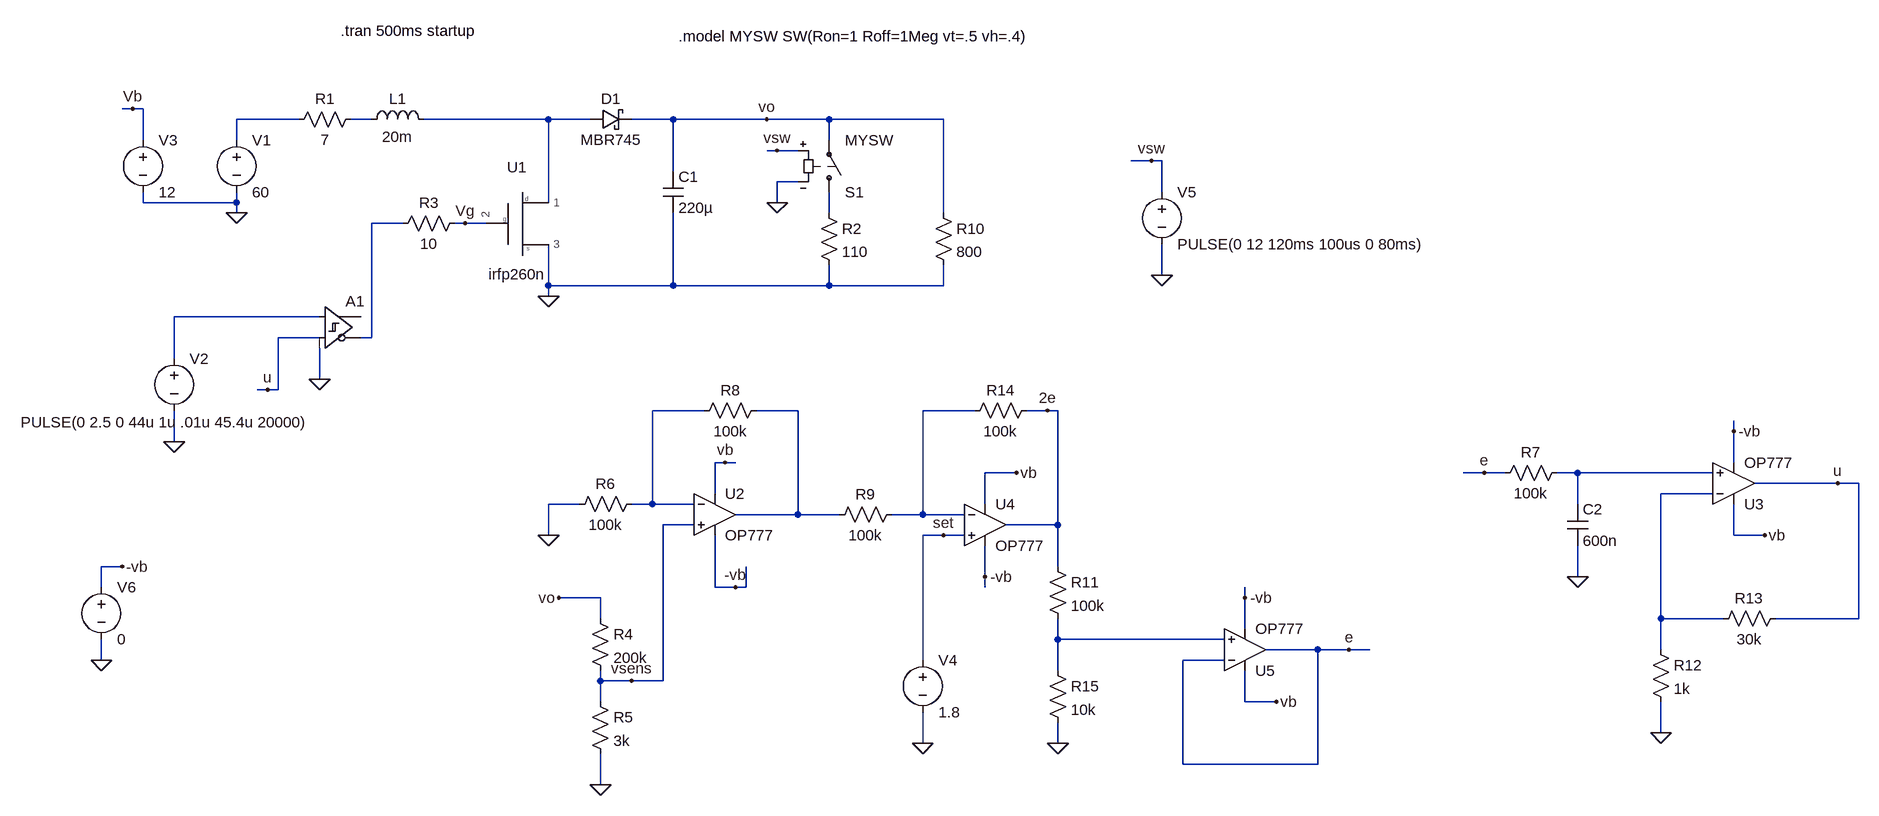
[diagram p0: schematic boost_control.asc]
boost_control.asc, the LTspice schematic file:
Version 4
SHEET 1 2420 1188
WIRE -240 48 -256 48
WIRE -224 48 -240 48
WIRE 16 64 -80 64
WIRE 128 64 96 64
WIRE 400 64 208 64
WIRE 464 64 400 64
WIRE 592 64 528 64
WIRE 736 64 592 64
WIRE 832 64 736 64
WIRE 1008 64 832 64
WIRE -224 96 -224 48
WIRE -80 96 -80 64
WIRE 832 96 832 64
WIRE 752 112 736 112
WIRE 784 112 752 112
WIRE 1328 128 1296 128
WIRE 1344 128 1328 128
WIRE 592 144 592 64
WIRE 784 160 752 160
WIRE 1344 176 1344 128
WIRE -224 192 -224 176
WIRE -80 192 -80 176
WIRE -80 192 -224 192
WIRE 400 192 400 64
WIRE 752 192 752 160
WIRE -80 208 -80 192
WIRE 832 208 832 176
WIRE 1008 208 1008 64
WIRE 176 224 128 224
WIRE 272 224 256 224
WIRE 304 224 272 224
WIRE 1344 304 1344 256
WIRE 400 320 400 256
WIRE 592 320 592 208
WIRE 592 320 400 320
WIRE 832 320 832 288
WIRE 832 320 592 320
WIRE 1008 320 1008 288
WIRE 1008 320 832 320
WIRE 400 336 400 320
WIRE 48 368 -176 368
WIRE 48 400 -16 400
WIRE 128 400 128 224
WIRE 128 400 112 400
WIRE -176 432 -176 368
WIRE 48 464 48 416
WIRE -32 480 -48 480
WIRE -16 480 -16 400
WIRE -16 480 -32 480
WIRE 640 512 560 512
WIRE 784 512 720 512
WIRE 1056 512 976 512
WIRE 1168 512 1136 512
WIRE 1184 512 1168 512
WIRE 2224 544 2224 528
WIRE -176 560 -176 512
WIRE 672 592 656 592
WIRE 688 592 672 592
WIRE 2224 592 2224 544
WIRE 1120 608 1072 608
WIRE 1840 608 1808 608
WIRE 1872 608 1840 608
WIRE 1984 608 1952 608
WIRE 2192 608 1984 608
WIRE 2384 624 2256 624
WIRE 2416 624 2384 624
WIRE 656 640 656 592
WIRE 2192 640 2112 640
WIRE 448 656 400 656
WIRE 560 656 560 512
WIRE 560 656 528 656
WIRE 624 656 560 656
WIRE 1072 656 1072 608
WIRE 1984 656 1984 608
WIRE 784 672 784 512
WIRE 784 672 688 672
WIRE 848 672 784 672
WIRE 976 672 976 512
WIRE 976 672 928 672
WIRE 1040 672 976 672
WIRE 624 688 576 688
WIRE 1184 688 1184 512
WIRE 1184 688 1104 688
WIRE 400 704 400 656
WIRE 1008 704 976 704
WIRE 1040 704 1008 704
WIRE 2224 704 2224 656
WIRE 2272 704 2224 704
WIRE -256 752 -288 752
WIRE 1184 752 1184 688
WIRE 1072 768 1072 720
WIRE 1984 768 1984 720
WIRE -288 784 -288 752
WIRE 656 784 656 704
WIRE 688 784 656 784
WIRE 704 784 704 752
WIRE 704 784 688 784
WIRE 1072 784 1072 768
WIRE 480 800 416 800
WIRE 1472 800 1472 784
WIRE 480 832 480 800
WIRE 2112 832 2112 640
WIRE 2208 832 2112 832
WIRE 2416 832 2416 624
WIRE 2416 832 2288 832
WIRE 1472 848 1472 800
WIRE 1184 864 1184 832
WIRE 1440 864 1184 864
WIRE 1584 880 1504 880
WIRE 1632 880 1584 880
WIRE 1664 880 1632 880
WIRE 2112 880 2112 832
WIRE -288 896 -288 864
WIRE 976 896 976 704
WIRE 1440 896 1376 896
WIRE 1184 912 1184 864
WIRE 480 928 480 912
WIRE 528 928 480 928
WIRE 576 928 576 688
WIRE 576 928 528 928
WIRE 480 960 480 928
WIRE 1472 960 1472 912
WIRE 1520 960 1472 960
WIRE 2112 1008 2112 960
WIRE 976 1024 976 976
WIRE 1184 1024 1184 992
WIRE 1376 1056 1376 896
WIRE 1584 1056 1584 880
WIRE 1584 1056 1376 1056
WIRE 480 1088 480 1040
FLAG 400 336 0
FLAG -80 208 0
FLAG 736 64 vo
FLAG 48 464 0
FLAG -176 560 0
FLAG 272 224 Vg
FLAG -32 480 u
FLAG 416 800 vo
FLAG 480 1088 0
FLAG -240 48 Vb
FLAG 1120 608 vb
FLAG 976 1024 0
FLAG 672 592 vb
FLAG 1008 704 set
FLAG 752 192 0
FLAG 752 112 vsw
FLAG 1344 304 0
FLAG 1328 128 vsw
FLAG -288 896 0
FLAG -256 752 -vb
FLAG 688 784 -vb
FLAG 1072 768 -vb
FLAG 1168 512 2e
FLAG 2272 704 vb
FLAG 2224 544 -vb
FLAG 1984 768 0
FLAG 2112 1008 0
FLAG 1840 608 e
FLAG 2384 624 u
FLAG 400 704 0
FLAG 528 928 vsens
FLAG 1184 1024 0
FLAG 1520 960 vb
FLAG 1472 800 -vb
FLAG 1632 880 e
SYMBOL voltage -80 80 R0
WINDOW 123 0 0 Left 0
WINDOW 39 0 0 Left 0
SYMATTR InstName V1
SYMATTR Value 60
SYMBOL res 112 48 R90
WINDOW 0 0 56 VBottom 2
WINDOW 3 32 56 VTop 2
SYMATTR InstName R1
SYMATTR Value 7
SYMBOL ind 112 80 R270
WINDOW 0 32 56 VTop 2
WINDOW 3 5 56 VBottom 2
SYMATTR InstName L1
SYMATTR Value 20m
SYMATTR SpiceLine Rser=.5 Rpar=10Meg
SYMBOL cap 576 144 R0
SYMATTR InstName C1
SYMATTR Value 220µ
SYMATTR SpiceLine Rser=.1 Rpar=1Meg
SYMBOL res 816 192 R0
SYMATTR InstName R2
SYMATTR Value 110
SYMBOL res 272 208 R90
WINDOW 0 0 56 VBottom 2
WINDOW 3 32 56 VTop 2
SYMATTR InstName R3
SYMATTR Value 10
SYMBOL schottky 464 80 R270
WINDOW 0 32 32 VTop 2
WINDOW 3 0 32 VBottom 2
SYMATTR InstName D1
SYMATTR Value MBR745
SYMBOL voltage -176 416 R0
WINDOW 3 -236 114 Left 2
WINDOW 123 0 0 Left 0
WINDOW 39 0 0 Left 0
SYMATTR Value PULSE(0 2.5 0 44u 1u .01u 45.4u 20000)
SYMATTR InstName V2
SYMBOL Digital\\diffschmitt 48 320 R0
SYMATTR InstName A1
SYMATTR SpiceLine Vhigh=12 Vh=0 Vt=0
SYMBOL res 464 816 R0
SYMATTR InstName R4
SYMATTR Value 200k
SYMBOL res 464 944 R0
SYMATTR InstName R5
SYMATTR Value 3k
SYMBOL voltage -224 80 R0
WINDOW 123 0 0 Left 0
WINDOW 39 0 0 Left 0
SYMATTR InstName V3
SYMATTR Value 12
SYMBOL voltage 976 880 R0
WINDOW 123 0 0 Left 0
WINDOW 39 0 0 Left 0
SYMATTR InstName V4
SYMATTR Value 1.8
SYMBOL sw 832 192 M180
SYMATTR InstName S1
SYMATTR Value MYSW
SYMBOL res 992 192 R0
SYMATTR InstName R10
SYMATTR Value 800
SYMBOL voltage 1344 160 R0
WINDOW 123 0 0 Left 0
WINDOW 39 0 0 Left 0
SYMATTR InstName V5
SYMATTR Value PULSE(0 12 120ms 100us 0 80ms)
SYMBOL OpAmps\\OP777 1072 624 R0
SYMATTR InstName U4
SYMBOL OpAmps\\OP777 656 608 R0
SYMATTR InstName U2
SYMBOL voltage -288 768 R0
WINDOW 123 0 0 Left 0
WINDOW 39 0 0 Left 0
SYMATTR InstName V6
SYMATTR Value 0
SYMBOL OpAmps\\OP777 2224 688 M180
SYMATTR InstName U3
SYMBOL res 1968 592 R90
WINDOW 0 0 56 VBottom 2
WINDOW 3 32 56 VTop 2
SYMATTR InstName R7
SYMATTR Value 100k
SYMBOL cap 1968 656 R0
SYMATTR InstName C2
SYMATTR Value 600n
SYMBOL res 2096 864 R0
SYMATTR InstName R12
SYMATTR Value 1k
SYMBOL res 2304 816 R90
WINDOW 0 0 56 VBottom 2
WINDOW 3 32 56 VTop 2
SYMATTR InstName R13
SYMATTR Value 30k
SYMBOL res 544 640 R90
WINDOW 0 0 56 VBottom 2
WINDOW 3 32 56 VTop 2
SYMATTR InstName R6
SYMATTR Value 100k
SYMBOL res 736 496 R90
WINDOW 0 0 56 VBottom 2
WINDOW 3 32 56 VTop 2
SYMATTR InstName R8
SYMATTR Value 100k
SYMBOL res 944 656 R90
WINDOW 0 0 56 VBottom 2
WINDOW 3 32 56 VTop 2
SYMATTR InstName R9
SYMATTR Value 100k
SYMBOL res 1152 496 R90
WINDOW 0 0 56 VBottom 2
WINDOW 3 32 56 VTop 2
SYMATTR InstName R14
SYMATTR Value 100k
SYMBOL res 1168 736 R0
SYMATTR InstName R11
SYMATTR Value 100k
SYMBOL res 1168 896 R0
SYMATTR InstName R15
SYMATTR Value 10k
SYMBOL OpAmps\\OP777 1472 944 M180
SYMATTR InstName U5
SYMBOL AutoGenerated\\irfp260n 352 224 R0
SYMATTR InstName U1
TEXT 80 -72 Left 2 !.tran 500ms startup
TEXT 600 -64 Left 2 !.model MYSW SW(Ron=1 Roff=1Meg vt=.5 vh=.4)

The netlist it stands for:
* boost_control.asc
V1 N001 0 60
R1 N002 N001 7
L1 N002 N003 20m Rser=.5 Rpar=10Meg
C1 vo 0 220µ Rser=.1 Rpar=1Meg
R2 N004 0 110
R3 Vg N005 10
D1 N003 vo MBR745
V2 N006 0 PULSE(0 2.5 0 44u 1u .01u 45.4u 20000)
A1 N006 u 0 0 0 N005 0 0 SCHMITT Vhigh=12 Vh=0 Vt=0
R4 vo vsens 200k
R5 vsens 0 3k
V3 Vb 0 12
V4 set 0 1.8
S1 N004 vo vsw 0 MYSW
R10 vo 0 800
V5 vsw 0 PULSE(0 12 120ms 100us 0 80ms)
XU4 set N009 Vb -vb 2e OP777  ; pins In+ In- V+ V- OUT
XU2 vsens N007 Vb -vb N008 OP777  ; pins In+ In- V+ V- OUT
V6 -vb 0 0
XU3 N010 N011 Vb -vb u OP777  ; pins In+ In- V+ V- OUT
R7 N010 e 100k
C2 N010 0 600n
R12 N011 0 1k
R13 u N011 30k
R6 N007 0 100k
R8 N008 N007 100k
R9 N009 N008 100k
R14 2e N009 100k
R11 2e N012 100k
R15 N012 0 10k
XU5 N012 e Vb -vb e OP777  ; pins In+ In- V+ V- OUT
XU1 N003 Vg 0 irfp260n  ; pins 1 2 3
.model D D
.lib standard.dio
.tran 500ms startup
.model MYSW SW(Ron=1 Roff=1Meg vt=.5 vh=.4)
.lib ADI.lib
.lib C:\Users\R Esteban A\Documents\LTspiceXVII\BoostConverter\irfp260n.txt
.backanno
.end